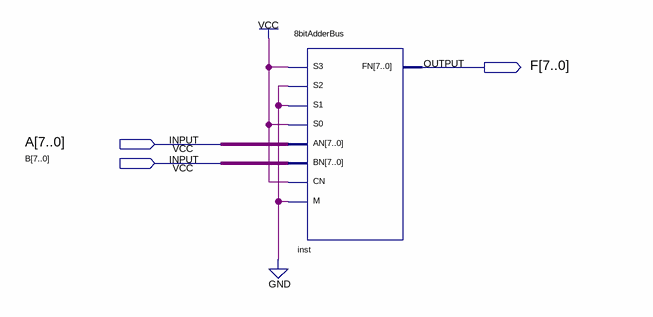
[diagram p0: schematic sheet]
// Quartus schematic 8bitADD.bdf as structural Verilog: 1 symbols, 3 pins
module \8bitADD  (
  input  [7:0] A,
  input  [7:0] B,
  output [7:0] F
);

  \8bitAdderBus  inst (.S3(1'b1), .S2(1'b0), .S1(1'b0), .S0(1'b1), .AN(A), .BN(B), .CN(1'b1), .M(1'b0), .FN(F));
endmodule
